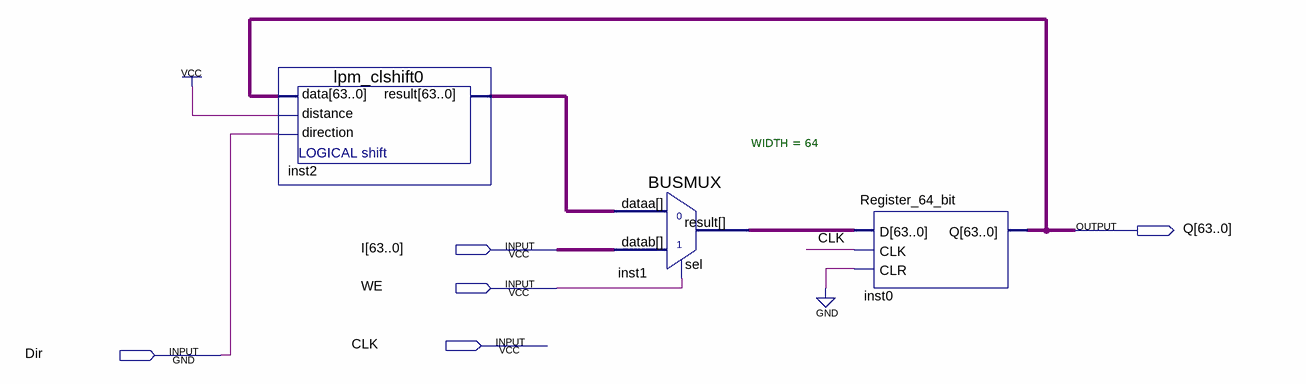
[diagram p0: schematic sheet]
// Quartus schematic Shift_Register_64_bit.bdf as structural Verilog: 3 symbols, 5 pins
module Shift_Register_64_bit (
  input  [63:0] I,
  input  WE,
  input  CLK,
  input  Dir,
  output [63:0] Q
);

  wire [63:0] inst1_result, inst2_result;

  lpm_clshift0 inst2 (.data(Q), .distance(1'b1), .direction(Dir), .result(inst2_result));
  BUSMUX #(.WIDTH(64)) inst1 (.datab(I), .sel(WE), .dataa(inst2_result), .result(inst1_result));
  Register_64_bit inst0 (.D(inst1_result), .CLK(CLK), .CLR(1'b0), .Q(Q));
endmodule
